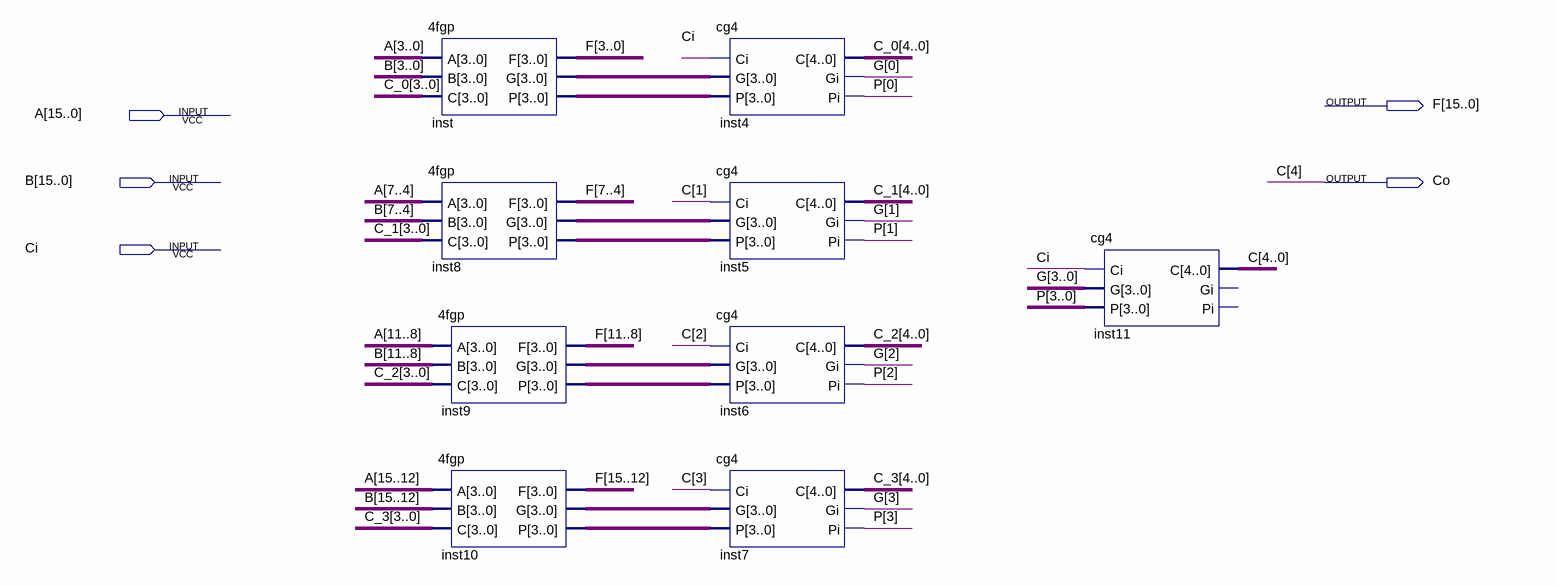
[diagram p0: schematic sheet]
// Quartus schematic add16.bdf as structural Verilog: 9 symbols, 5 pins
module add16 (
  input  [15:0] A,
  input  [15:0] B,
  input  Ci,
  output [15:0] F,
  output Co
);

  wire [3:0] C, G, inst8_g, inst8_p, inst9_g, inst9_p, inst10_g, inst10_p, inst_g, inst_p, P;
  wire [4:0] C_0, C_1, C_2, C_3;

  \4fgp  inst (.A(A[3:0]), .B(B[3:0]), .C(C_0[3:0]), .P(inst_p), .F(F[3:0]), .G(inst_g));
  \4fgp  inst8 (.A(A[7:4]), .B(B[7:4]), .C(C_1[3:0]), .P(inst8_p), .F(F[7:4]), .G(inst8_g));
  \4fgp  inst9 (.A(A[11:8]), .B(B[11:8]), .C(C_2[3:0]), .P(inst9_p), .F(F[11:8]), .G(inst9_g));
  \4fgp  inst10 (.A(A[15:12]), .B(B[15:12]), .C(C_3[3:0]), .P(inst10_p), .F(F[15:12]), .G(inst10_g));
  cg4 inst4 (.Ci(Ci), .G(inst_g), .P(inst_p), .C(C_0), .Gi(G[0]), .Pi(P[0]));
  cg4 inst5 (.Ci(C[1]), .G(inst8_g), .P(inst8_p), .C(C_1), .Gi(G[1]), .Pi(P[1]));
  cg4 inst6 (.Ci(C[2]), .G(inst9_g), .P(inst9_p), .C(C_2), .Gi(G[2]), .Pi(P[2]));
  cg4 inst7 (.Ci(C[3]), .G(inst10_g), .P(inst10_p), .C(C_3), .Gi(G[3]), .Pi(P[3]));
  cg4 inst11 (.Ci(Ci), .G(G), .P(P), .C({Co, C}));  // open: Gi, Pi

  // Other names for the same wires on the sheet: C[4] = Co
endmodule
